# EAGLE design 2x3AND_OR_1 (EAGLE 6.5.0)

## Sheet 1 of 3
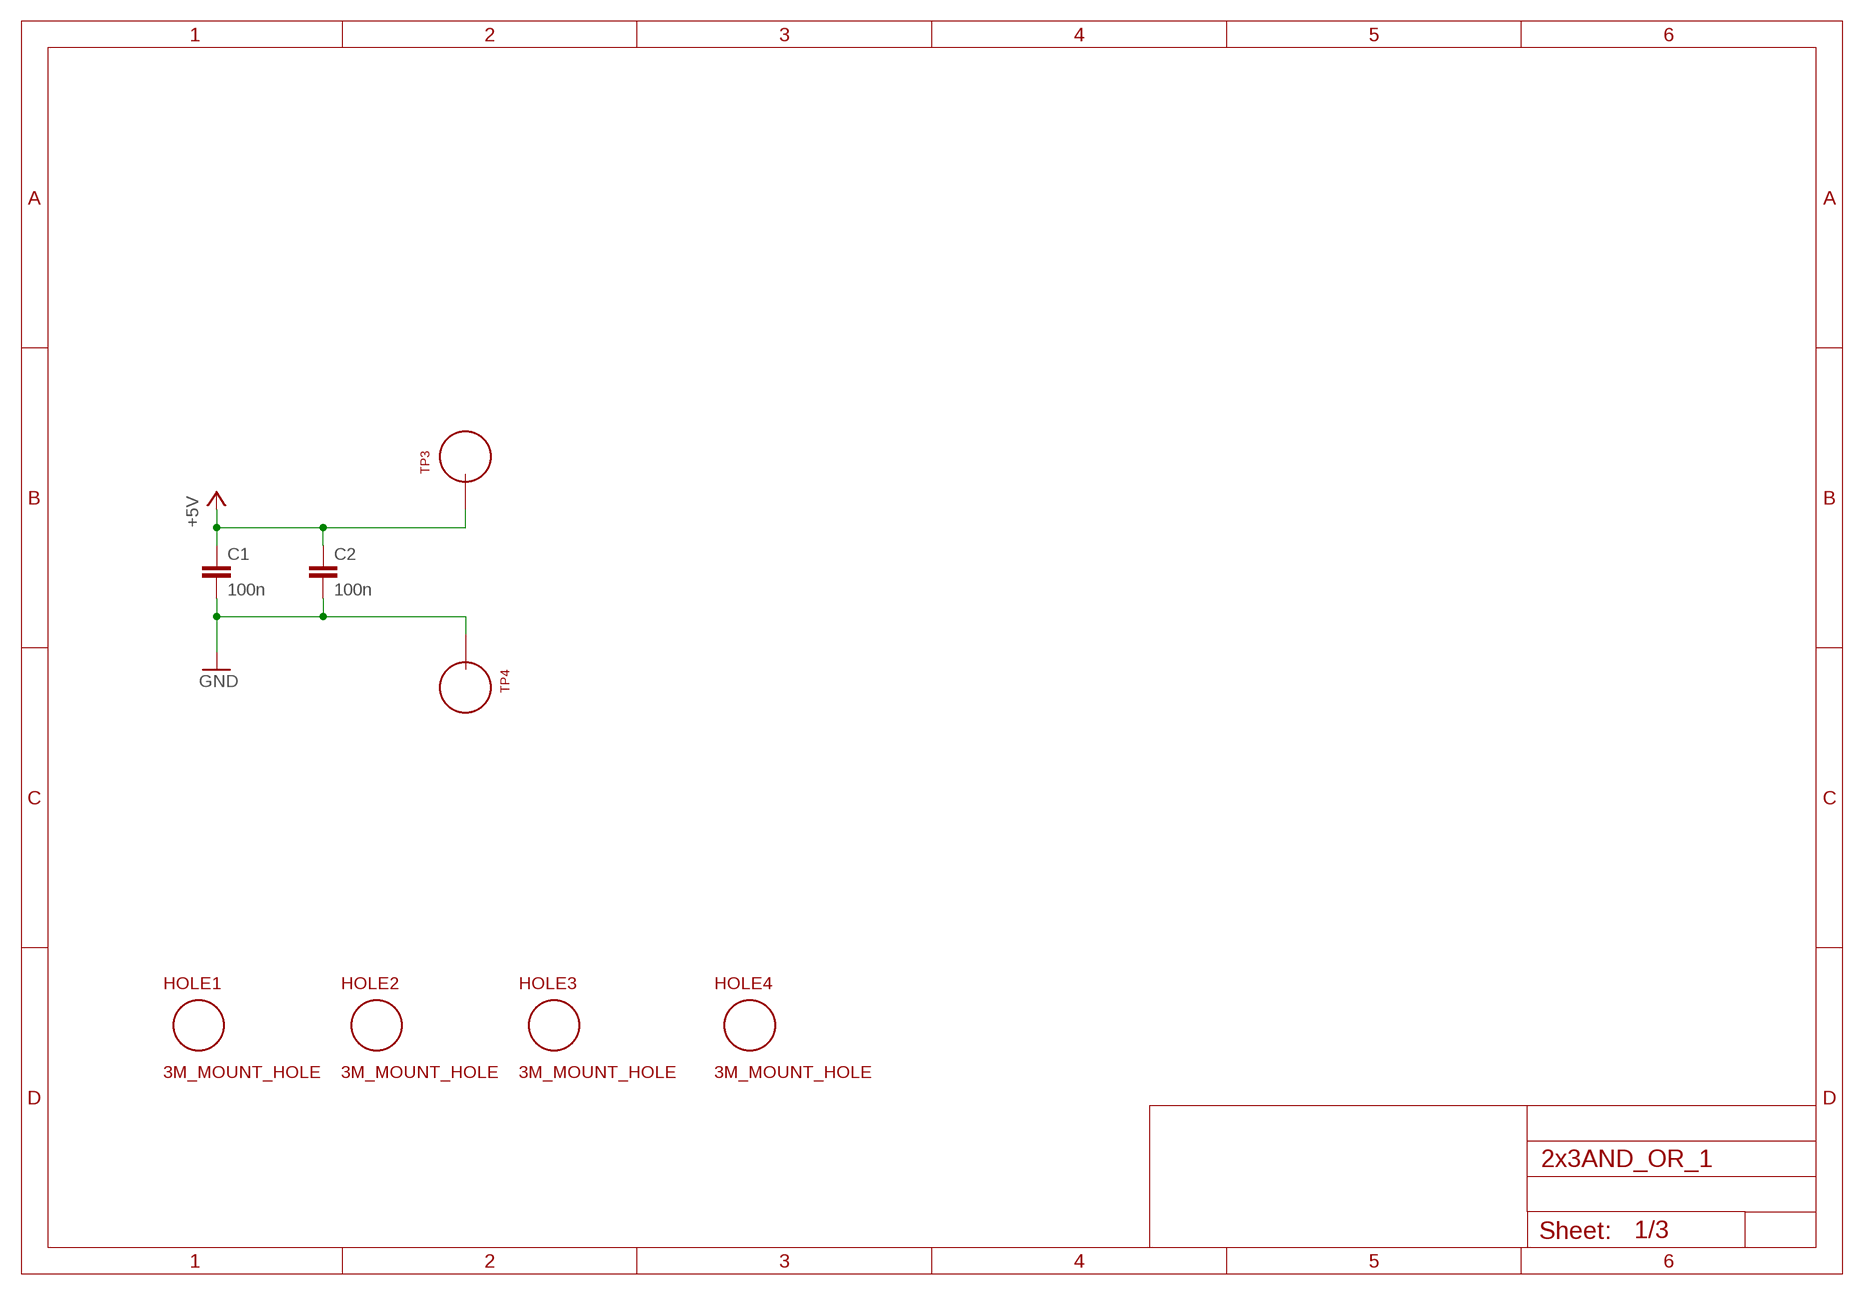
[diagram p0: schematic, sheet 1]

### Parts
C1  100n  C_P2INCH  [CAP_P2INCH]
C2  100n  C_P2INCH  [CAP_P2INCH]
HOLE1  3M_MOUNT_HOLE  [3M_HOLE]
HOLE2  3M_MOUNT_HOLE  [3M_HOLE]
HOLE3  3M_MOUNT_HOLE  [3M_HOLE]
HOLE4  3M_MOUNT_HOLE  [3M_HOLE]
TP3  TEST_LOOP  [TEST_LOOP]
TP4  TEST_LOOP  [TEST_LOOP]

### Nets
+5V: C1.1 C2.1 TP3.P$1 ; also sheet 2,3
GND: C1.2 C2.2 TP4.P$1 ; also sheet 2,3

## Sheet 2 of 3
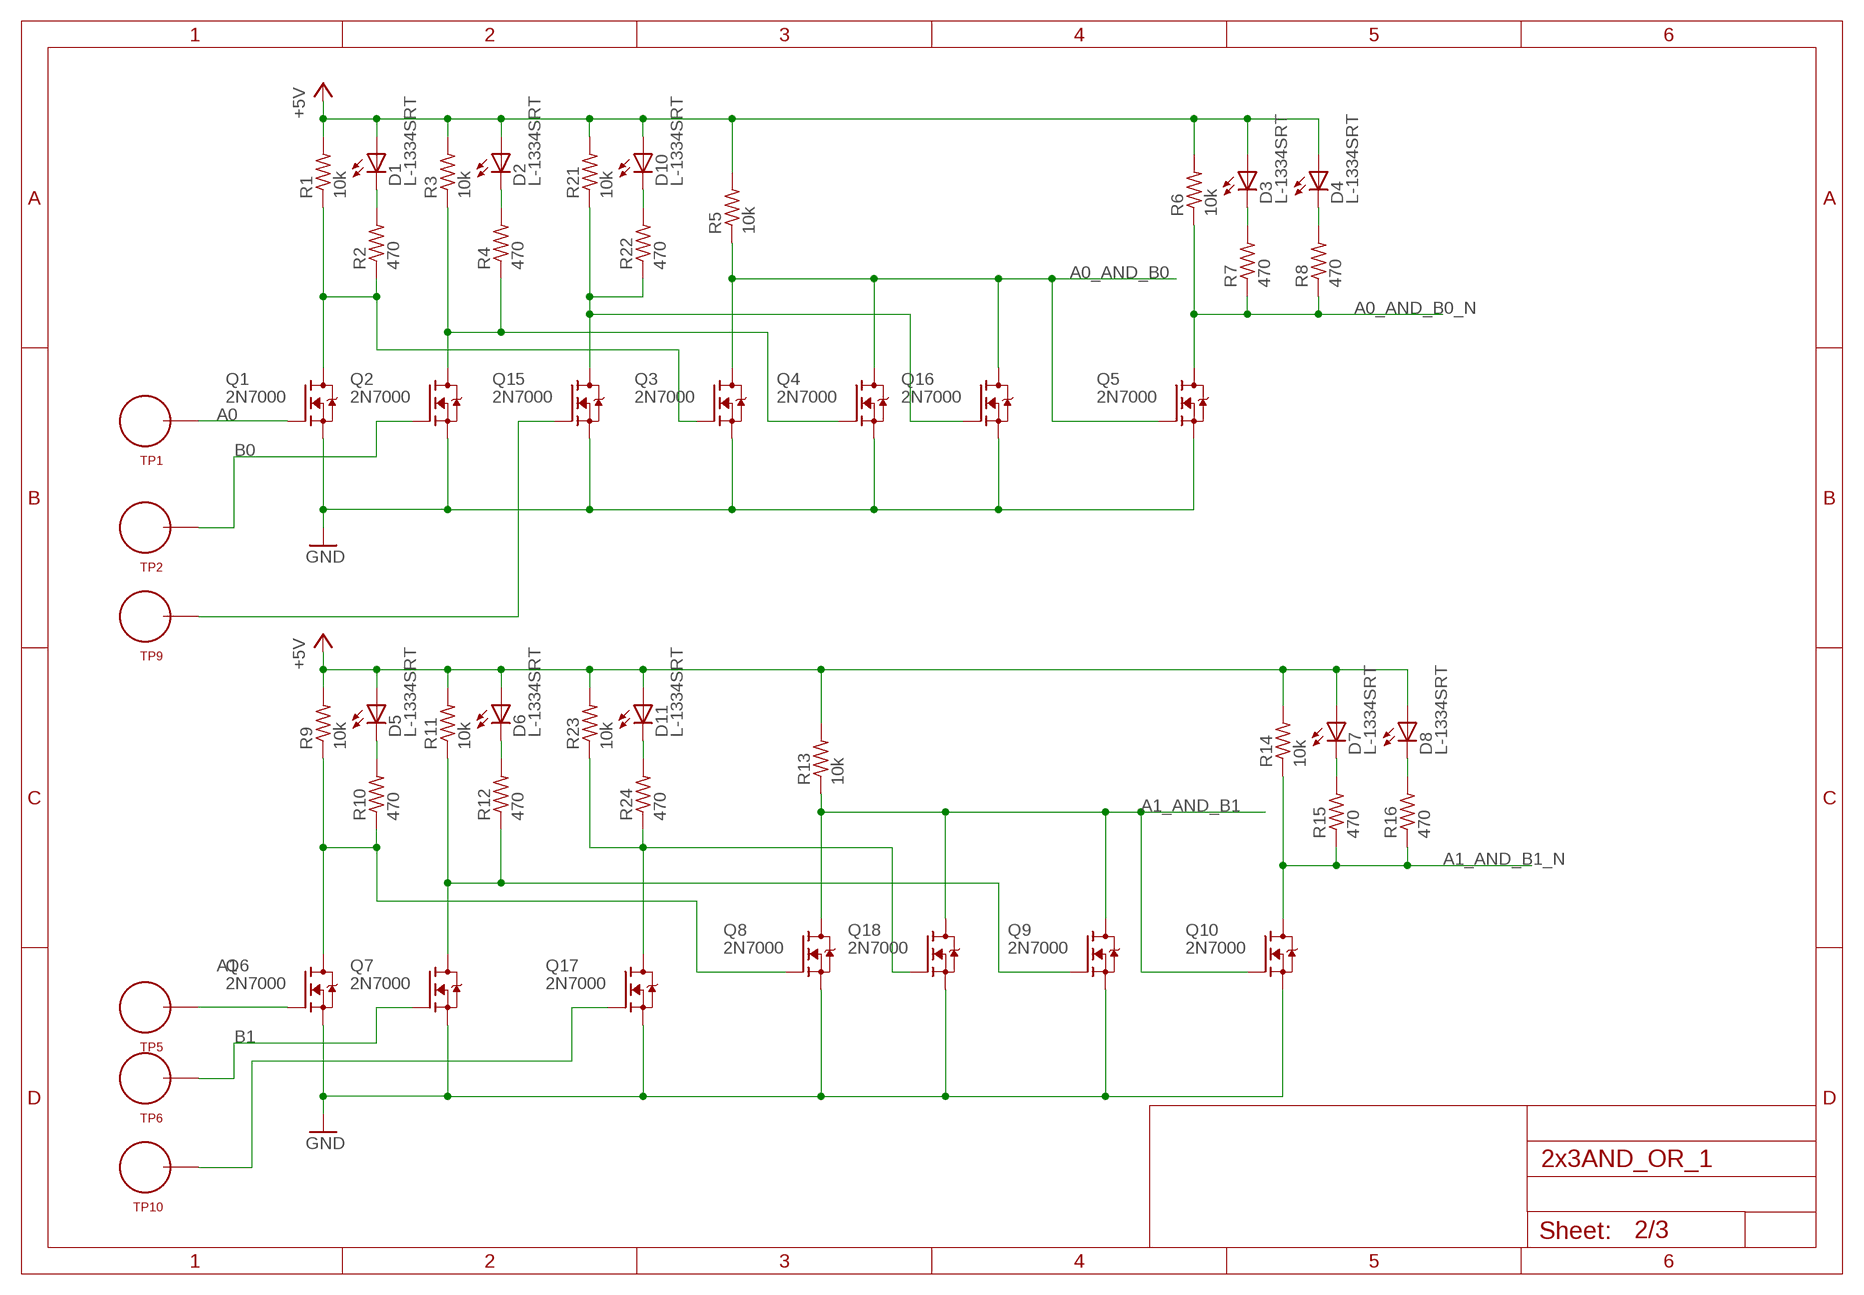
[diagram p1: schematic, sheet 2]

### Parts
D1  L-1334SRT  [LED3MM]
D2  L-1334SRT  [LED3MM]
D3  L-1334SRT  [LED3MM]
D4  L-1334SRT  [LED3MM]
D5  L-1334SRT  [LED3MM]
D6  L-1334SRT  [LED3MM]
D7  L-1334SRT  [LED3MM]
D8  L-1334SRT  [LED3MM]
D10  L-1334SRT  [LED3MM]
D11  L-1334SRT  [LED3MM]
Q1  2N7000  [TO92-DGS]
Q2  2N7000  [TO92-DGS]
Q3  2N7000  [TO92-DGS]
Q4  2N7000  [TO92-DGS]
Q5  2N7000  [TO92-DGS]
Q6  2N7000  [TO92-DGS]
Q7  2N7000  [TO92-DGS]
Q8  2N7000  [TO92-DGS]
Q9  2N7000  [TO92-DGS]
Q10  2N7000  [TO92-DGS]
Q15  2N7000  [TO92-DGS]
Q16  2N7000  [TO92-DGS]
Q17  2N7000  [TO92-DGS]
Q18  2N7000  [TO92-DGS]
R1  10k  R_P2INCH  [R_P2INCH]
R2  470  R_P2INCH  [R_P2INCH]
R3  10k  R_P2INCH  [R_P2INCH]
R4  470  R_P2INCH  [R_P2INCH]
R5  10k  R_P2INCH  [R_P2INCH]
R6  10k  R_P2INCH  [R_P2INCH]
R7  470  R_P2INCH  [R_P2INCH]
R8  470  R_P2INCH  [R_P2INCH]
R9  10k  R_P2INCH  [R_P2INCH]
R10  470  R_P2INCH  [R_P2INCH]
R11  10k  R_P2INCH  [R_P2INCH]
R12  470  R_P2INCH  [R_P2INCH]
R13  10k  R_P2INCH  [R_P2INCH]
R14  10k  R_P2INCH  [R_P2INCH]
R15  470  R_P2INCH  [R_P2INCH]
R16  470  R_P2INCH  [R_P2INCH]
R21  10k  R_P2INCH  [R_P2INCH]
R22  470  R_P2INCH  [R_P2INCH]
R23  10k  R_P2INCH  [R_P2INCH]
R24  470  R_P2INCH  [R_P2INCH]
TP1  TEST_LOOP  [TEST_LOOP]
TP2  TEST_LOOP  [TEST_LOOP]
TP5  TEST_LOOP  [TEST_LOOP]
TP6  TEST_LOOP  [TEST_LOOP]
TP9  TEST_LOOP  [TEST_LOOP]
TP10  TEST_LOOP  [TEST_LOOP]

### Nets
+5V: D1.A D2.A D3.A D4.A D5.A D6.A D7.A D8.A D10.A D11.A R1.2 R3.2 R5.2 R6.2 R9.2 R11.2 R13.2 R14.2 R21.2 R23.2 ; also sheet 1,3
A0: Q1.G TP1.P$1
A0_AND_B0: Q3.D Q4.D Q5.G Q16.D R5.1 ; also sheet 3
A0_AND_B0_N: Q5.D R6.1 R7.1 R8.1
A1: Q6.G TP5.P$1
A1_AND_B1: Q8.D Q9.D Q10.G Q18.D R13.1 ; also sheet 3
A1_AND_B1_N: Q10.D R14.1 R15.1 R16.1
B0: Q2.G TP2.P$1
B1: Q7.G TP6.P$1
GND: Q1.S Q2.S Q3.S Q4.S Q5.S Q6.S Q7.S Q8.S Q9.S Q10.S Q15.S Q16.S Q17.S Q18.S ; also sheet 1,3
N$1: D1.K(C) R2.2
N$2: Q1.D Q3.G R1.1 R2.1
N$3: D4.K(C) R8.2
N$4: D2.K(C) R4.2
N$5: Q2.D Q4.G R3.1 R4.1
N$6: D5.K(C) R10.2
N$7: Q6.D Q8.G R9.1 R10.1
N$8: D6.K(C) R12.2
N$9: D3.K(C) R7.2
N$10: Q7.D Q9.G R11.1 R12.1
N$11: D7.K(C) R15.2
N$12: D8.K(C) R16.2
N$14: Q15.G TP9.P$1
N$15: Q15.D Q16.G R21.1 R22.1
N$16: D10.K(C) R22.2
N$17: D11.K(C) R24.2
N$18: Q17.D Q18.G R23.1 R24.1
N$20: Q17.G TP10.P$1

## Sheet 3 of 3
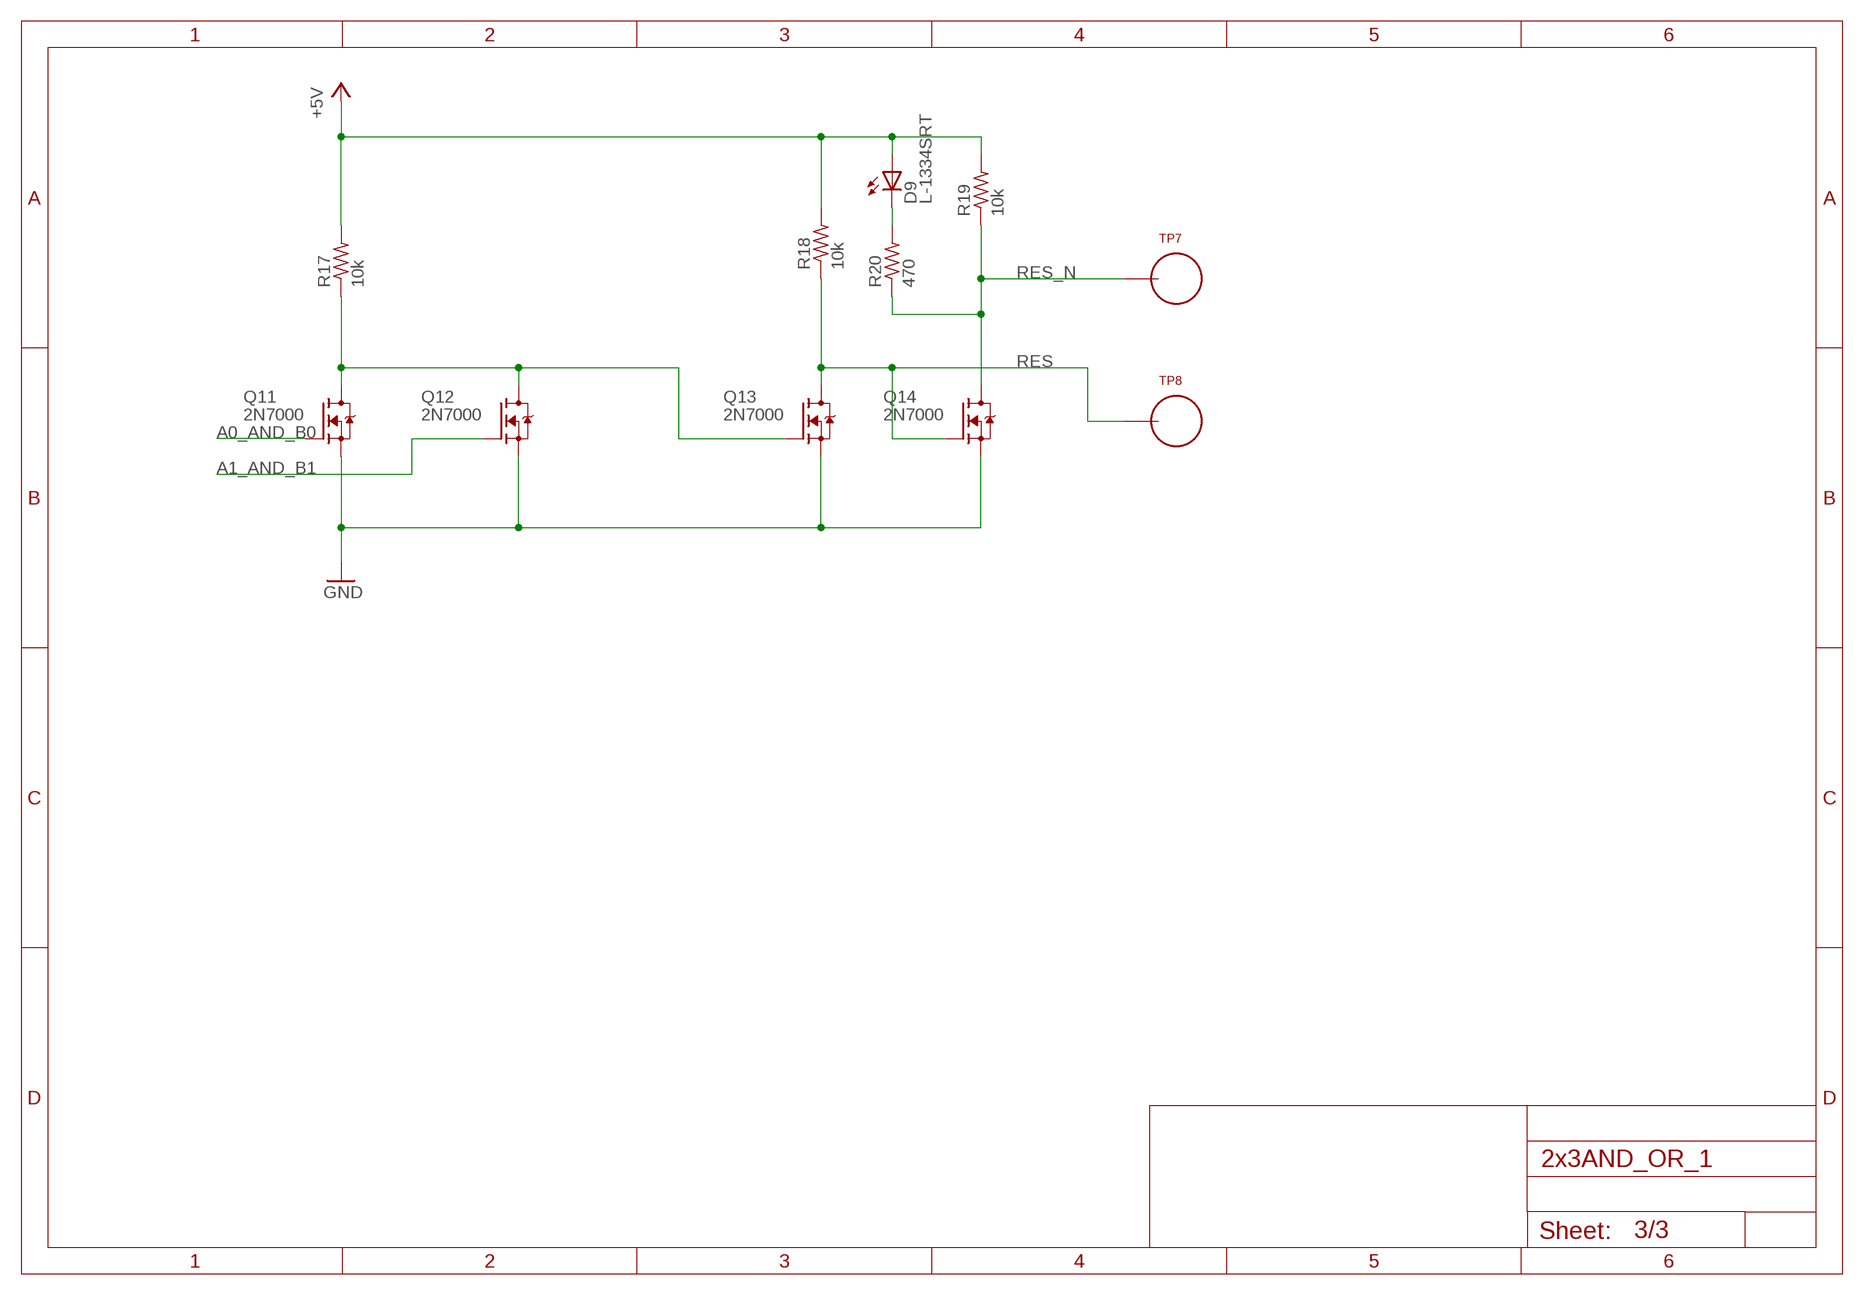
[diagram p2: schematic, sheet 3]

### Parts
D9  L-1334SRT  [LED3MM]
Q11  2N7000  [TO92-DGS]
Q12  2N7000  [TO92-DGS]
Q13  2N7000  [TO92-DGS]
Q14  2N7000  [TO92-DGS]
R17  10k  R_P2INCH  [R_P2INCH]
R18  10k  R_P2INCH  [R_P2INCH]
R19  10k  R_P2INCH  [R_P2INCH]
R20  470  R_P2INCH  [R_P2INCH]
TP7  TEST_LOOP  [TEST_LOOP]
TP8  TEST_LOOP  [TEST_LOOP]

### Nets
+5V: D9.A R17.2 R18.2 R19.2 ; also sheet 1,2
A0_AND_B0: Q11.G ; also sheet 2
A1_AND_B1: Q12.G ; also sheet 2
GND: Q11.S Q12.S Q13.S Q14.S ; also sheet 1,2
N$13: Q11.D Q12.D Q13.G R17.1
N$19: D9.K(C) R20.2
RES: Q13.D Q14.G R18.1 TP8.P$1
RES_N: Q14.D R19.1 R20.1 TP7.P$1

## Library data of the parts
C1 C2 = MyLib:C_P2INCH
D1-D11 = MyLib:L-1334SRT
HOLE1-HOLE4 = MyLib:3M_MOUNT_HOLE
Q1-Q18 = MyLib:2N7000
R1-R24 = MyLib:R_P2INCH
TP1-TP10 = MyLib:TEST_LOOP

## Board
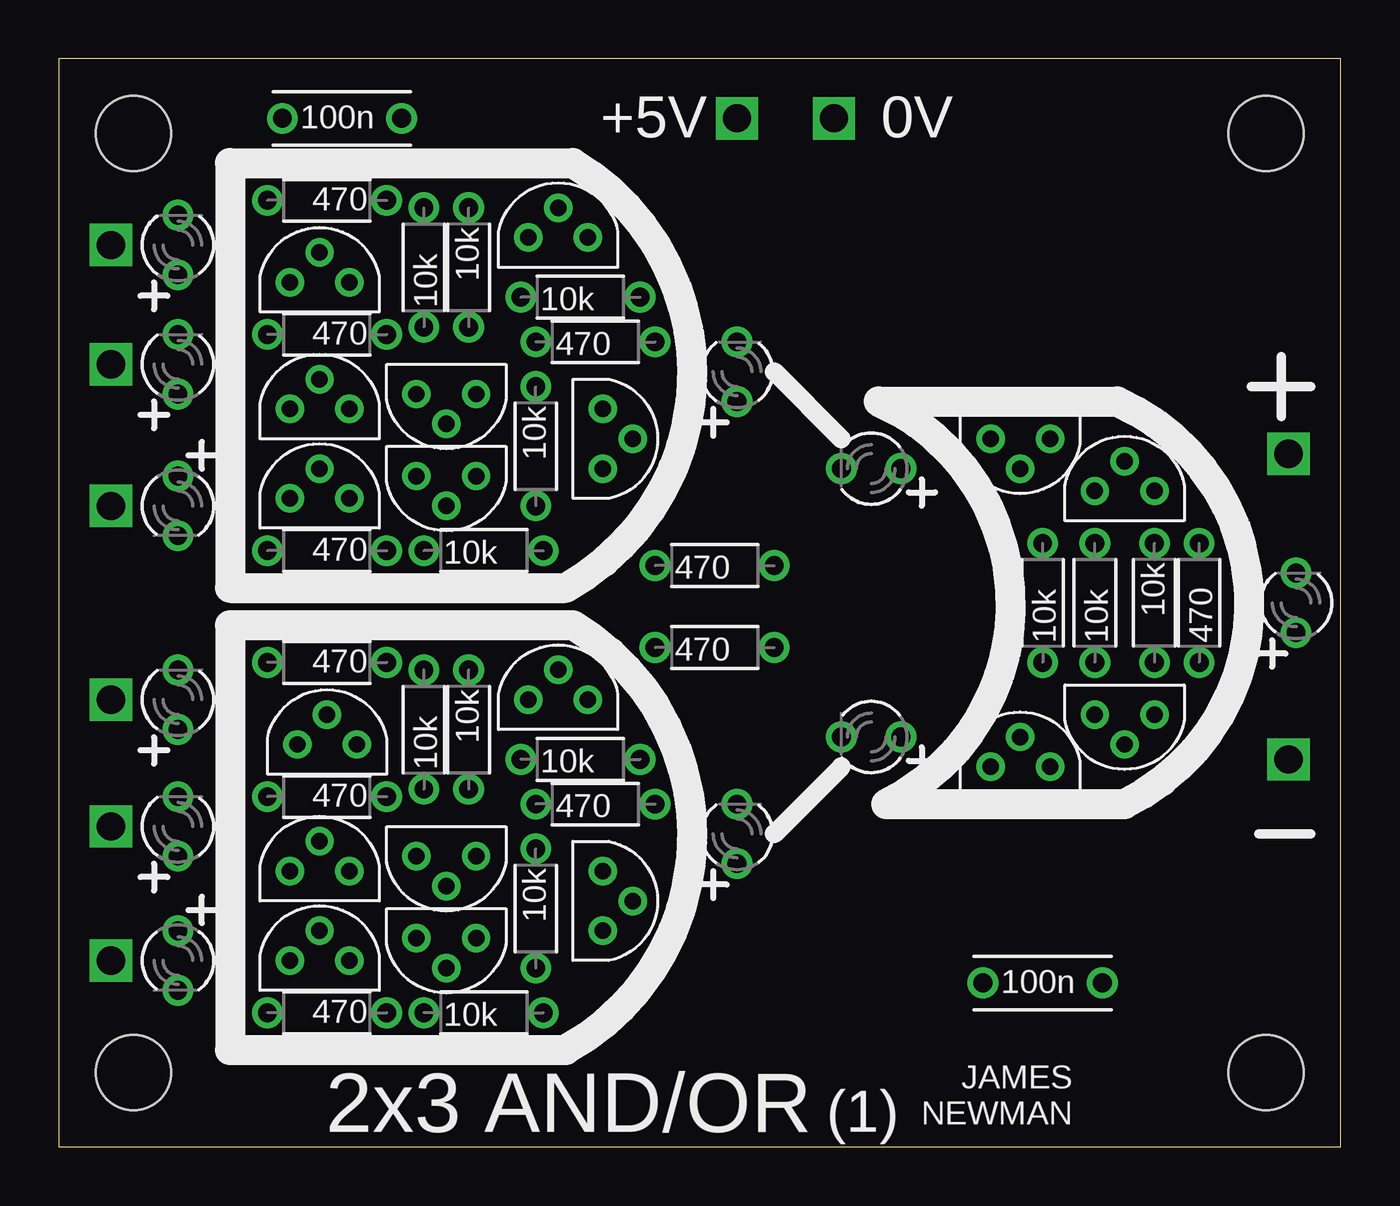
[diagram p3: board, top side]
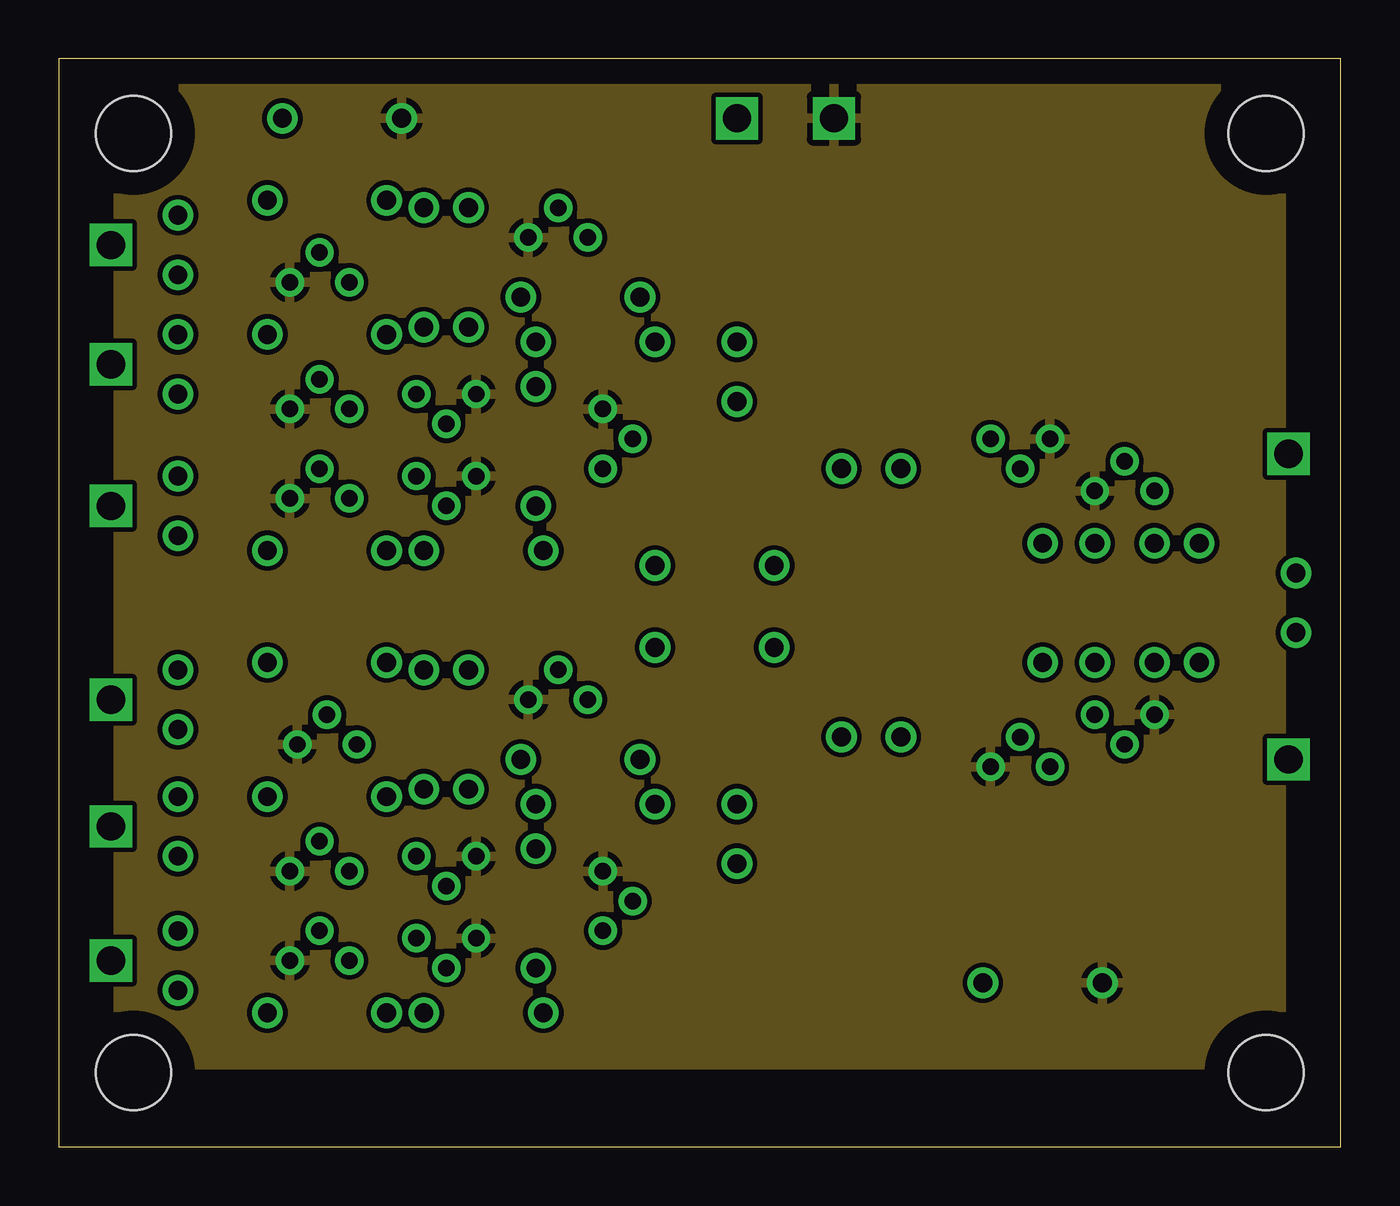
[diagram p4: board, inner layer Route2]
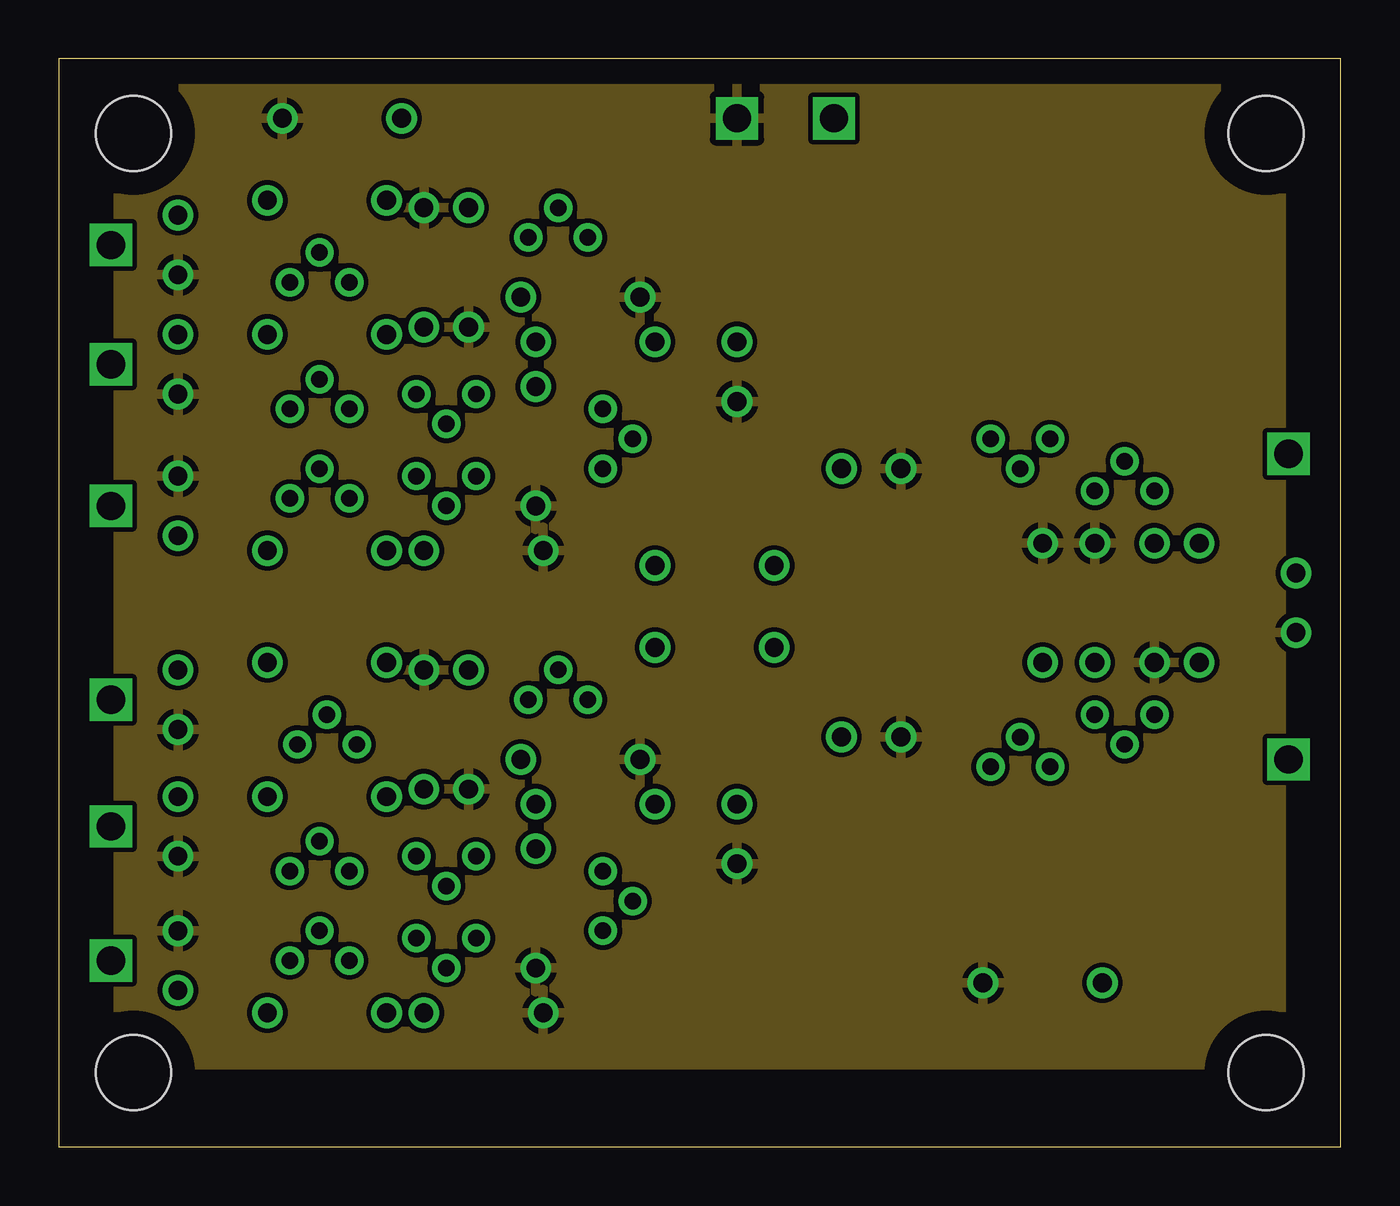
[diagram p5: board, inner layer Route3]
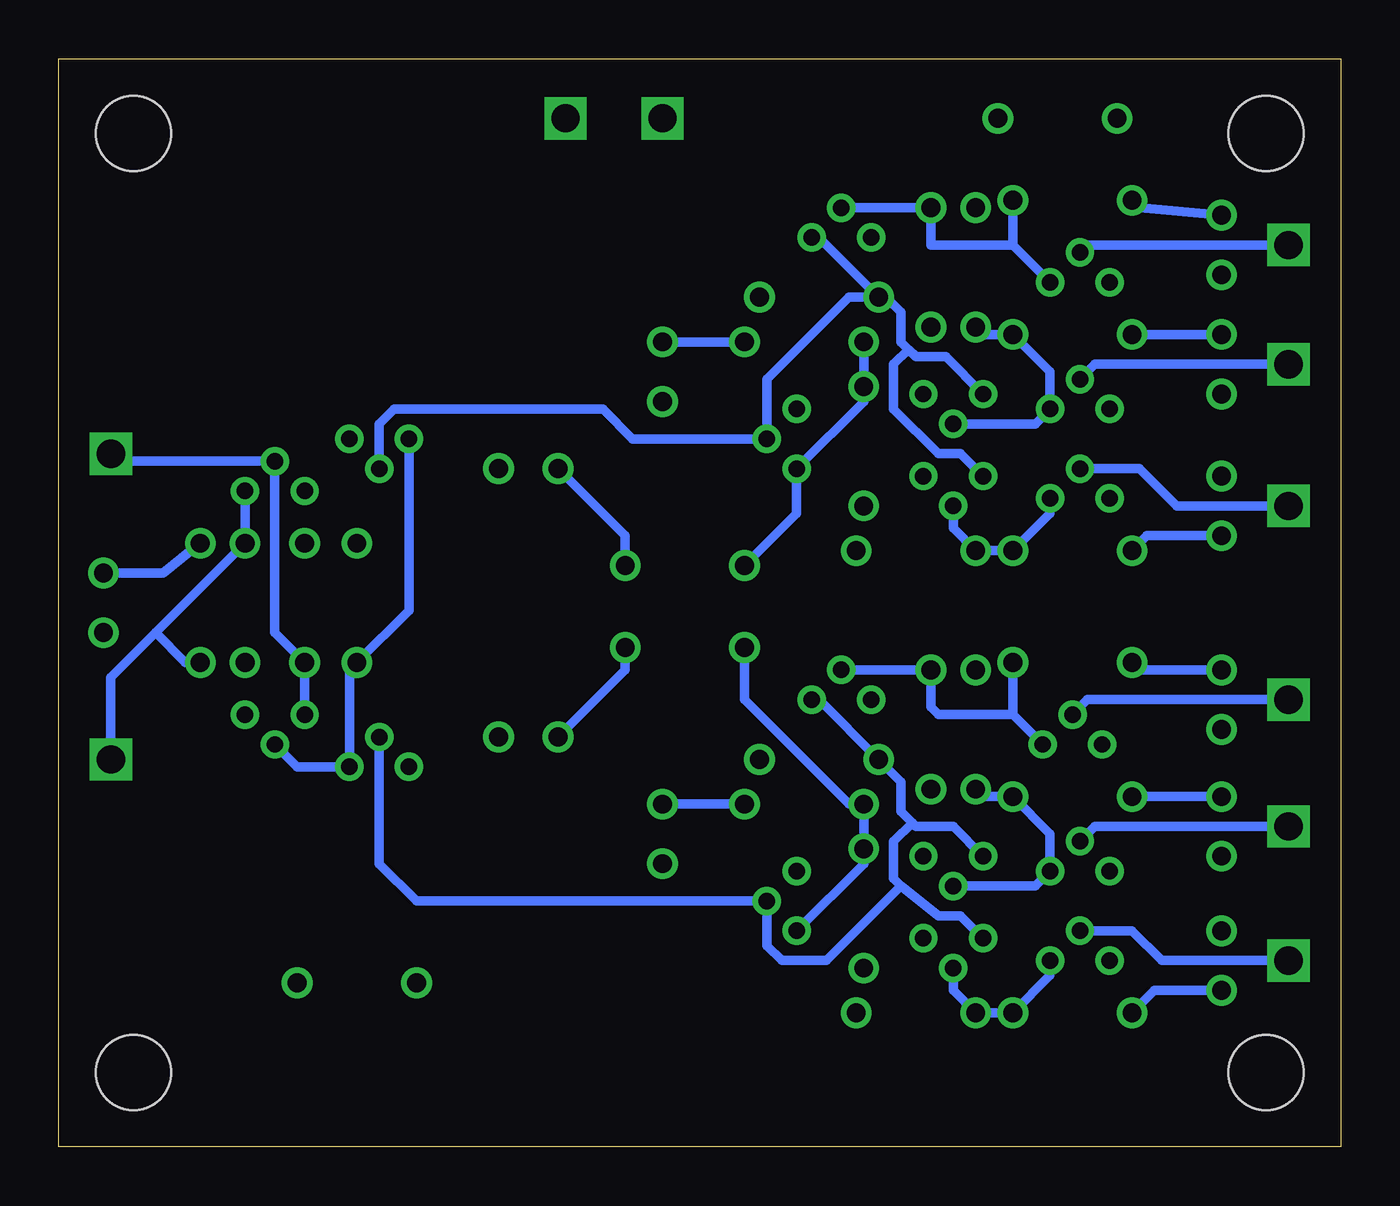
[diagram p6: board, bottom side, seen from below]

Size 54.61 x 46.35 mm. Coordinates in mm from the lower left corner, seen from the top.
Outline: 0,0 54.61,0 54.61,46.35 0,46.35 0,0
Copper layers (1*2+3*16): Top 0.035mm / dielectric 0.2mm / Route2 0.035mm / dielectric 1mm / Route3 0.035mm / dielectric 0.2mm / Bottom 0.035mm
Design rules "processor_rules_4layer": minimum track width 10mil, minimum drill 0.0236mm, track to track 8mil, track to pad 8mil, pad to pad 8mil, via to via 8mil, smd to smd 8mil, copper to edge 40mil, drill to drill 8mil, minimum pad ring 10mil, minimum via ring 8mil, stop-mask expansion 4mil, vias tented up to drill 0.7mm, thermal gap 10mil

### Footprints (pad centres in the part's own frame; a part is rotated, then mirrored left to right if it is on the bottom)
CAP_P2INCH = drill 0.8: 1 -2.54,0; 2 2.54,0
LED3MM = drill 0.8: A -1.27,0; K 1.27,0
3M_HOLE = hole 3.2: 0,0
TO92-DGS = drill 0.7: D 0,1.27; G -1.27,0; S 0,-1.27
R_P2INCH = drill 0.8: 1 -2.54,0; 2 2.54,0
TEST_LOOP = drill 1.2 square: P$1 0,0

### Placement (x,y rotation side)
C1  12.06,43.81 0 top
C2  41.91,6.99 0 top
D1  5.08,38.42 90 top
D2  5.08,27.3 270 top
D3  28.89,33.02 90 top
D4  34.61,28.89 180 top
D5  5.08,19.05 90 top
D6  5.08,7.94 270 top
D7  28.89,13.34 90 top
D8  34.61,17.46 180 top
D9  52.7,23.18 90 top
D10  5.08,33.34 90 top
D11  5.08,13.65 90 top
HOLE1  3.17,3.17 0 top
HOLE2  51.44,3.17 0 top
HOLE3  3.17,43.18 0 top
HOLE4  51.44,43.18 0 top
Q1  11.11,36.83 270 top
Q2  11.11,27.62 270 top
Q3  21.27,38.73 270 top
Q4  16.51,28.57 90 top
Q5  23.18,30.16 180 top
Q6  11.43,17.14 270 top
Q7  11.11,7.94 270 top
Q8  21.27,19.05 270 top
Q9  16.51,8.89 90 top
Q10  23.18,10.48 180 top
Q11  40.96,30.16 90 top
Q12  40.96,16.19 270 top
Q13  45.4,18.41 90 top
Q14  45.4,27.94 270 top
Q15  11.11,31.43 270 top
Q16  16.51,32.07 90 top
Q17  11.11,11.75 270 top
Q18  16.51,12.38 90 top
R1  17.46,37.47 270 top
R2  11.43,40.32 180 top
R3  18.1,25.4 0 top
R4  11.43,25.4 180 top
R5  22.23,36.2 0 top
R6  20.32,29.84 270 top
R7  22.86,34.29 0 top
R8  27.94,24.77 0 top
R9  17.46,17.78 270 top
R10  11.43,20.64 180 top
R11  18.1,5.71 0 top
R12  11.43,5.71 180 top
R13  22.23,16.51 0 top
R14  20.32,10.16 270 top
R15  22.86,14.61 0 top
R16  27.94,21.27 0 top
R17  41.91,23.18 90 top
R18  44.13,23.18 90 top
R19  46.67,23.18 270 top
R20  48.58,23.18 90 top
R21  15.56,37.47 90 top
R22  11.43,34.61 180 top
R23  15.56,17.78 90 top
R24  11.43,14.92 180 top
TP1  2.22,38.42 0 top
TP2  2.22,27.3 0 top
TP3  28.89,43.81 0 top
TP4  33.02,43.81 0 top
TP5  2.22,19.05 0 top
TP6  2.22,7.94 0 top
TP7  52.39,16.51 0 top
TP8  52.39,29.53 0 top
TP9  2.22,33.34 0 top
TP10  2.22,13.65 0 top

### Tracks (layer width: path | path; a pad name or v marks a point on that pad's centre or on a via)
+5V
  pour Route3: 2.54,45.09 2.54,3.49 52.07,3.49 52.07,45.09
A0
  Bottom 0.406: TP1.P$1 10.79,38.42 Q1.G
A0_AND_B0
  Bottom 0.406: Q3.D 22.23,38.73 R5.1 | R5.1 20.95,36.2 24.45,32.7 Q5.G 30.16,30.16 31.43,31.43 40.32,31.43 40.96,30.8 Q11.G | R5.1 19.37,36.2 18.73,35.56 18.73,34.29 18.41,33.97 | 18.41,33.97 18.1,33.66 16.83,33.66 Q16.D | Q4.D 16.19,29.53 17.14,29.53 19.05,31.43 19.05,33.34 18.41,33.97
A0_AND_B0_N
  Bottom 0.406: R7.1 R6.1 20.32,31.75 Q5.D 23.18,26.99 R8.1
A1
  Bottom 0.406: TP5.P$1 10.79,19.05 Q6.G
A1_AND_B1
  Bottom 0.406: Q8.D 22.23,19.05 R13.1 18.73,15.56 18.73,14.29 18.26,13.81 | 18.26,13.81 18.1,13.65 16.51,13.65 Q18.D | Q9.D 16.19,9.84 17.14,9.84 18.73,11.11 | 18.26,13.81 19.05,13.02 19.05,11.43 18.73,11.11 | Q12.G 40.96,12.06 39.37,10.48 Q10.G 24.45,8.57 23.81,7.94 21.91,7.94 18.73,11.11
A1_AND_B1_N
  Bottom 0.406: Q10.D 20.32,12.06 R14.1 R15.1 20.95,14.61 25.4,19.05 R16.1
B0
  Bottom 0.406: TP2.P$1 6.99,27.3 8.57,28.89 Q2.G
B1
  Bottom 0.406: TP6.P$1 7.62,7.94 8.89,9.21 Q7.G
GND
  pour Route2: 2.54,3.49 51.75,3.49 52.07,2.86 52.07,45.09 2.54,45.09
N$1
  Bottom 0.406: D1.K 8.57,40.01 R2.2
N$2
  Bottom 0.406: R2.1 13.97,38.42 | 13.97,38.42 Q1.D | 13.97,38.42 17.46,38.42 R1.1 Q3.G
N$3
  Bottom 0.406: R8.2 30.48,26.04 D4.K
N$4
  Bottom 0.406: D2.K 8.26,26.04 R4.2
N$5
  Bottom 0.406: Q2.D 12.38,26.99 R4.1 R3.1 16.51,26.35 Q4.G
N$6
  Bottom 0.406: D5.K 8.57,20.32 R10.2
N$7
  Bottom 0.406: R10.1 13.97,18.41 | 13.97,18.41 Q6.D | 13.97,18.41 17.14,18.41 17.46,18.73 R9.1 Q8.G
N$8
  Bottom 0.406: D6.K 7.94,6.67 R12.2
N$9
  Bottom 0.406: R7.2 D3.K
N$10
  Bottom 0.406: Q7.D 12.38,7.3 R12.1 R11.1 16.51,6.67 Q9.G
N$11
  Bottom 0.406: R15.2 D7.K
N$12
  Bottom 0.406: R16.2 30.48,20.32 D8.K
N$13
  Bottom 0.406: Q13.G 44.45,16.19 Q12.D 42.23,20.32 R17.1 39.69,22.86 Q11.D
N$14
  Bottom 0.406: TP9.P$1 10.48,33.34 Q15.G
N$15
  Bottom 0.406: Q16.G 13.02,30.8 Q15.D 12.38,33.02 R22.1 15.56,34.61 R21.1
N$16
  Bottom 0.406: D10.K R22.2
N$17
  Bottom 0.406: D11.K R24.2
N$18
  Bottom 0.406: R23.1 15.24,14.92 R24.1 12.38,13.34 Q17.D 13.02,11.11 Q18.G
N$19
  Bottom 0.406: D9.K 50.16,24.45 R20.2
N$20
  Bottom 0.406: TP10.P$1 10.48,13.65 Q17.G
RES
  Bottom 0.406: TP8.P$1 52.07,29.21 Q14.G 45.4,21.91 R18.1 Q13.D
RES_N
  Bottom 0.406: Q14.D R19.1 50.48,21.91 | 50.48,21.91 52.39,20 TP7.P$1 | R20.1 49.21,20.64 50.48,21.91

### Text on the board
tPlace: +5V | 0V | 2x3 AND/OR | JAMES / NEWMAN | (1)